# EAGLE schematic Decagon (EAGLE 6.4)
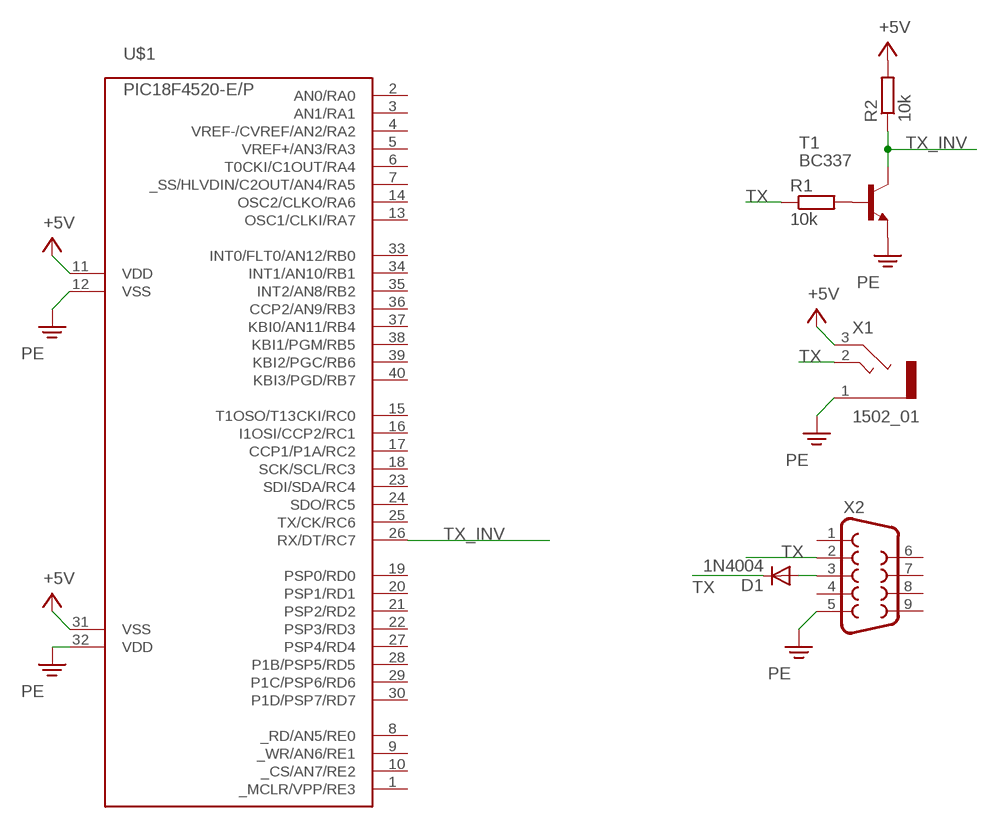
[diagram p0: schematic, sheet 1]

## Parts
D1  1N4004  [DO41-10]
R1  10k  R-EU_0207/10  [0207/10]
R2  10k  R-EU_0207/10  [0207/10]
T1  BC337  [TO92]
U$1  PIC18F4520-E/P  [DIL40]
X1  1502_01  [1502_01]
X2  F09VP  [F09VP]

## Nets
N$1: R1.2 T1.2(B)
N$2: D1.A X2.3
PE: T1.1(E) U$1.12(VSS) U$1.32(VDD) X1.1 X2.5
TX: D1.C R1.1 X1.2 X2.2
TX_INV: R2.1 T1.3(C) U$1.26(RX/DT/RC7)
V+: R2.2 U$1.11(VDD) U$1.31(VSS) X1.3 ; supply symbol labelled +5V
Unconnected: U$1.1(_MCLR/VPP/RE3) U$1.2(AN0/RA0) U$1.3(AN1/RA1) U$1.4(VREF-/CVREF/AN2/RA2) U$1.5(VREF+/AN3/RA3) U$1.6(T0CKI/C1OUT/RA4) U$1.7(_SS/HLVDIN/C2OUT/AN4/RA5) U$1.8(_RD/AN5/RE0) U$1.9(_WR/AN6/RE1) U$1.10(_CS/AN7/RE2) U$1.13(OSC1/CLKI/RA7) U$1.14(OSC2/CLKO/RA6) U$1.15(T1OSO/T13CKI/RC0) U$1.16(I1OSI/CCP2/RC1) U$1.17(CCP1/P1A/RC2) U$1.18(SCK/SCL/RC3) U$1.19(PSP0/RD0) U$1.20(PSP1/RD1) U$1.21(PSP2/RD2) U$1.22(PSP3/RD3) U$1.23(SDI/SDA/RC4) U$1.24(SDO/RC5) U$1.25(TX/CK/RC6) U$1.27(PSP4/RD4) U$1.28(P1B/PSP5/RD5) U$1.29(P1C/PSP6/RD6) U$1.30(P1D/PSP7/RD7) U$1.33(INT0/FLT0/AN12/RB0) U$1.34(INT1/AN10/RB1) U$1.35(INT2/AN8/RB2) U$1.36(CCP2/AN9/RB3) U$1.37(KBI0/AN11/RB4) U$1.38(KBI1/PGM/RB5) U$1.39(KBI2/PGC/RB6) U$1.40(KBI3/PGD/RB7) X2.1 X2.4 X2.6 X2.7 X2.8 X2.9

## Library data of the parts
D1 = diode:1N4004: DIODE general purpose rectifier, 1 A
R1 R2 = resistor:R-EU_: RESISTOR, European symbol
T1 = transistor:BC337: NPN TRANSISTOR
U$1 = pic18fxx20-2:PIC18*4520: PIC18*4520 Microchip FLASH Microcontroller with A/D DEVICE FEATURES Feature PIC18*4520 Program Memory (bytes) 32768 Program Memory (instructions) 16384 Interupt Sources 20 I/O Ports Ports A, B, C, D, E Capture/Compare/PWM Modules 1 Enhanced Capture/Compare/PWM Modules 1 Parallel Communications (PSP) Yes 10-bit Analog-to-Digital Module 13 input Channels Package Types 40-pin PDIP 44-pin TQFP 44-pin QFN NOTES: F only after 18, means standard voltage range from 4.2v to 5.5v LF after 18, means extended voltage range from 2.0v to 5.5v -E before / denotes extended temperature range from -40°C to +120°C -I before / denotes industrial temperature range from -40°C to +85°C /PT suffix denotes TQFP package /SO suffix denotes SOIC package /SP suffix denotes Skinny Plastic DIP package /P suffix denotes Plastic DIP package /ML suffix denotes QFN package
X1 = con-lumberg:1502_01: Jack connectors according to JISC 6560, 3.5 mm Klinkensteckverbinder nach JISC 6560, 3,5 mm Source: http://www.lumberg.com/Produkte/PDFs/1502_01.pdf; OC_FARNELL: 4739747; OC_NEWARK: unknown
X2 = con-subd:F09: SUB-D; OC_FARNELL: unknown; OC_NEWARK: unknown